# Altium project sumo.PrjPCB
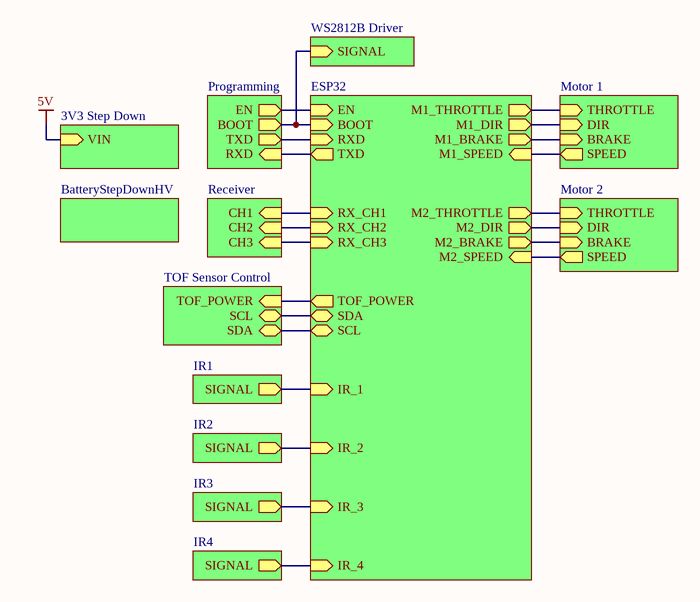
[diagram p0: sumo.SchDoc]
11 sheets, 167 parts. Net scope: hierarchical (ports join the sheet entries above them; power ports are global).
Board file: sumo.PcbDoc
Sheets:
  sumo.SchDoc
    3V3 Step Down = 3V3StepDown.SchDoc
    ESP32 = ESP32.SchDoc
    Motor 1 = MotorDriver.SchDoc
    Receiver = Receiver.SchDoc
    Programming = Programming.SchDoc
    TOF Sensor Control = TOFSensorControl.SchDoc
      VL53L0X_A = TOFSensor.SchDoc
      VL53L0X_B = TOFSensor.SchDoc
      VL53L0X_C = TOFSensor.SchDoc
      VL53L0X_D = TOFSensor.SchDoc
    WS2812B Driver = WS2812BDriver.SchDoc
    Motor 2 = MotorDriver.SchDoc
    BatteryStepDownHV = BatteryStepDownHV.SchDoc
    IR1 = IR.SchDoc
    IR2 = IR.SchDoc
    IR3 = IR.SchDoc
    IR4 = IR.SchDoc

## Sheet sumo.SchDoc
size A4

### Sub-sheets
3V3 Step Down = 3V3StepDown.SchDoc: VIN (in)
BatteryStepDownHV = BatteryStepDownHV.SchDoc: no entries
ESP32 = ESP32.SchDoc: EN (in), BOOT (in), RXD (in), TXD (out), M2_BRAKE (out), M1_BRAKE (out), M2_THROTTLE (out), M1_THROTTLE (out), RX_CH3 (in), M2_DIR (out), M1_DIR (out), RX_CH2 (in), RX_CH1 (in), IR_4 (in), IR_3 (in), IR_2 (in), IR_1 (in), SDA (bidir), SCL (bidir), TOF_POWER (out), M1_SPEED (in), M2_SPEED (in)
IR1 = IR.SchDoc: SIGNAL (out)
IR2 = IR.SchDoc: SIGNAL (out)
IR3 = IR.SchDoc: SIGNAL (out)
IR4 = IR.SchDoc: SIGNAL (out)
Motor 1 = MotorDriver.SchDoc: THROTTLE (in), DIR (in), BRAKE (in), SPEED (out)
Motor 2 = MotorDriver.SchDoc: THROTTLE (in), DIR (in), BRAKE (in), SPEED (out)
Programming = Programming.SchDoc: EN (out), BOOT (out), TXD (out), RXD (in)
Receiver = Receiver.SchDoc: CH1 (in), CH2 (in), CH3 (in)
TOF Sensor Control = TOFSensorControl.SchDoc: TOF_POWER (in), SCL (bidir), SDA (bidir)
WS2812B Driver = WS2812BDriver.SchDoc: SIGNAL (in)

### Nets
BOOT: sheet ESP32/BOOT, sheet Programming/BOOT, sheet WS2812B Driver/SIGNAL
EN: sheet ESP32/EN, sheet Programming/EN
RXD: sheet ESP32/RXD, sheet Programming/TXD
SCL: sheet ESP32/SCL, sheet TOF Sensor Control/SDA
SDA: sheet ESP32/SDA, sheet TOF Sensor Control/SCL
TXD: sheet ESP32/TXD, sheet Programming/RXD
NetC13_1_2: sheet ESP32/IR_1, sheet IR1/SIGNAL
NetC13_2_2: sheet ESP32/IR_2, sheet IR2/SIGNAL
NetC13_3_2: sheet ESP32/IR_3, sheet IR3/SIGNAL
NetC13_4_2: sheet ESP32/IR_4, sheet IR4/SIGNAL
NetR17_1_1: sheet ESP32/M1_THROTTLE, sheet Motor 1/THROTTLE
NetR17_2_1: sheet ESP32/M2_THROTTLE, sheet Motor 2/THROTTLE
NetR18_1_1: sheet ESP32/M1_DIR, sheet Motor 1/DIR
NetR18_2_1: sheet ESP32/M2_DIR, sheet Motor 2/DIR
NetR19_1_1: sheet ESP32/M1_BRAKE, sheet Motor 1/BRAKE
NetR19_2_1: sheet ESP32/M2_BRAKE, sheet Motor 2/BRAKE
NetR21_1_1: sheet ESP32/M1_SPEED, sheet Motor 1/SPEED
NetR21_2_1: sheet ESP32/M2_SPEED, sheet Motor 2/SPEED
NetR31_1: sheet ESP32/RX_CH3, sheet Receiver/CH3
NetR32_1: sheet ESP32/RX_CH2, sheet Receiver/CH2
NetR33_1: sheet ESP32/RX_CH1, sheet Receiver/CH1
NetR41_2: sheet ESP32/TOF_POWER, sheet TOF Sensor Control/TOF_POWER

## Sheet 3V3StepDown.SchDoc
size A4
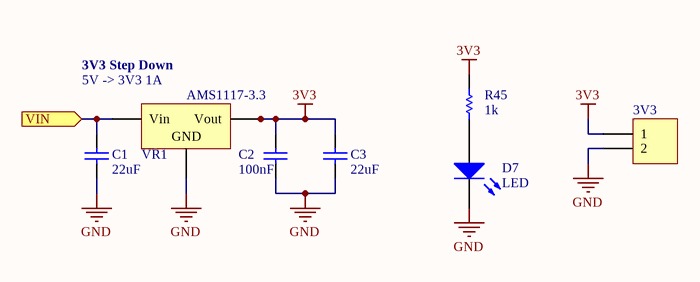
[diagram p1: 3V3StepDown.SchDoc]

### Parts
3V3  Header 2  [HDR1X2]  (value not drawn)
C1  value 22uF  [J1-0603]  (hidden comment: Cap)
C2  value 100nF  [J1-0603]  (hidden comment: Cap)
C3  value 22uF  [J1-0603]  (hidden comment: Cap)
D7  LED  [J1-0603 LED]
R45  value 1k  [J1-0603]  (hidden comment: Res1)
VR1  AMS1117-3.3  [SOT223-4M]

### Ports
VIN (in)

### Nets
3V3: 3V3.1 C2.2 C3.1 R45.2 VR1.2(Vout) VR1.4(Vout)
5V: C1.1 VR1.3(Vin) ; port VIN
GND: 3V3.2 C1.2 C2.1 C3.2 D7.2(K) VR1.1(GND)
NetD7_1: D7.1(A) R45.1

### Notes on the sheet
- (near VR1) 3V3 Step Down
- (near VR1) 5V -> 3V3 1A

### Library data of the parts
3V3 = Header 2: Header, 2-Pin; LatestRevisionDate: 17-Jul-2002; LatestRevisionNote: Re-released for DXP Platform.; Publisher: Altium Limited
C1-C3 = Cap: Capacitor; Published: 8-Jun-2000; LatestRevisionDate: 17-Jul-2002; LatestRevisionNote: Re-released for DXP Platform.; PackageReference: RAD-0.3; Publisher: Altium Limited; PackageDescription: Radial Cap, Thru-Hole; 2 Leads; 0.3 in Pin Spacing
  C1 C3: LCSC: C109447
  C2: LCSC: C153795
R45 = Res1: Resistor; Published: 8-Jun-2000; LatestRevisionDate: 17-Jul-2002; LatestRevisionNote: Re-released for DXP Platform.; PackageReference: AXIAL-0.3; Publisher: Altium Limited; PackageDescription: Axial Device, Thru-Hole; 2 Leads; 0.3 in Pin Spacing
VR1 = Volt Reg: Voltage Regulator; Published: 24-Mar-1999; LatestRevisionDate: 29-May-2009; LatestRevisionNote: IPC-7351 Footprint Added.; PackageReference: D2PAK; Publisher: Altium Limited; PackageDescription: 3-Pin Transistor Outline Package 2.54 mm Pitch, 15.1 mm Lead Span; LCSC: C165482
D7 = LED: Published: 8-Jun-2000; LatestRevisionDate: 17-Jul-2002; LatestRevisionNote: Re-released for DXP Platform.; PackageVersion: Feb-2002; PackageReference: 3.2X1.6X1.1; Publisher: Altium Limited; PackageDescription: SM LED; 2 Flat Leads; LCSC: C205450

## Sheet ESP32.SchDoc
size A4
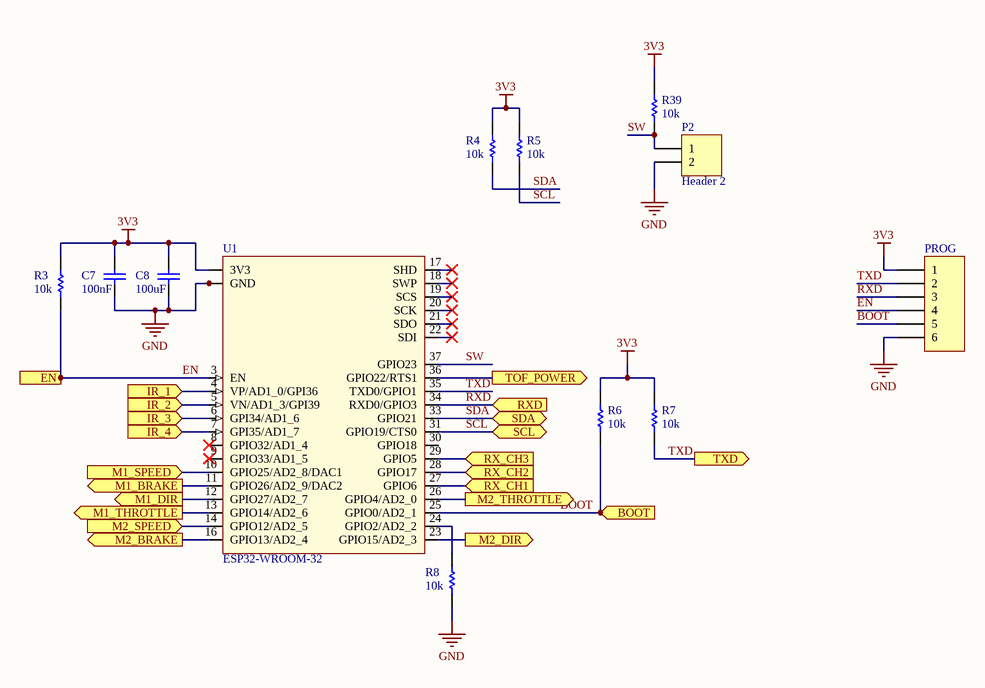
[diagram p2: ESP32.SchDoc]

### Parts
C7  value 100nF  [J1-0603]  (hidden comment: Cap)
C8  value 100uF  [C1210_M]  (hidden comment: Cap)
P2  Header 2  [HDR1X2]
PROG  Header 6  [HDR1X6]  (value not drawn)
R3  value 10k  [J1-0603]  (hidden comment: Res1)
R4  value 10k  [J1-0603]  (hidden comment: Res1)
R5  value 10k  [J1-0603]  (hidden comment: Res1)
R6  value 10k  [J1-0603]  (hidden comment: Res1)
R7  value 10k  [J1-0603]  (hidden comment: Res1)
R8  value 10k  [J1-0603]  (hidden comment: Res1)
R39  value 10k  [J1-0603]  (hidden comment: Res1)
U1  ESP32-WROOM-32  [ESP32-WROOM-32]

### Ports
BOOT (in), EN (in), IR_1 (in), IR_2 (in), IR_3 (in), IR_4 (in), M1_BRAKE (out), M1_DIR (out), M1_SPEED (in), M1_THROTTLE (out), M2_BRAKE (out), M2_DIR (out), M2_SPEED (in), M2_THROTTLE (out), RX_CH1 (in), RX_CH2 (in), RX_CH3 (in), RXD (in), SCL (bidir), SDA (bidir), TOF_POWER (out), TXD (out)

### Nets
3V3: C7.2 C8.2 PROG.1 R3.2 R4.2 R5.2 R6.2 R7.2 R39.2 U1.2(3V3)
GND: C7.1 C8.1 P2.2 PROG.6 R8.1 U1.1(GND) U1.15(GND) U1.38(GND) U1.39(GND)
BOOT: PROG.5 R6.1 U1.25(GPIO0/AD2_1) ; port BOOT
EN: PROG.4 R3.1 U1.3(EN) ; port EN
RXD: PROG.3 U1.34(RXD0/GPIO3) ; port RXD
SCL: R5.1 U1.31(GPIO19/CTS0) ; port SCL
SDA: R4.1 U1.33(GPIO21) ; port SDA
SW: P2.1 R39.1 U1.37(GPIO23)
TXD: PROG.2 R7.1 U1.35(TXD0/GPIO1) ; port TXD
NetC13_1_2: U1.4(VP/AD1_0/GPI36) ; port IR_1
NetC13_2_2: U1.5(VN/AD1_3/GPI39) ; port IR_2
NetC13_3_2: U1.6(GPI34/AD1_6) ; port IR_3
NetC13_4_2: U1.7(GPI35/AD1_7) ; port IR_4
NetR8_2: R8.2 U1.24(GPIO2/AD2_2)
NetR17_1_1: U1.13(GPIO14/AD2_6) ; port M1_THROTTLE
NetR17_2_1: U1.26(GPIO4/AD2_0) ; port M2_THROTTLE
NetR18_1_1: U1.12(GPIO27/AD2_7) ; port M1_DIR
NetR18_2_1: U1.23(GPIO15/AD2_3) ; port M2_DIR
NetR19_1_1: U1.11(GPIO26/AD2_9/DAC2) ; port M1_BRAKE
NetR19_2_1: U1.16(GPIO13/AD2_4) ; port M2_BRAKE
NetR21_1_1: U1.10(GPIO25/AD2_8/DAC1) ; port M1_SPEED
NetR21_2_1: U1.14(GPIO12/AD2_5) ; port M2_SPEED
NetR31_1: U1.29(GPIO5) ; port RX_CH3
NetR32_1: U1.28(GPIO17) ; port RX_CH2
NetR33_1: U1.27(GPIO6) ; port RX_CH1
NetR41_2: U1.36(GPIO22/RTS1) ; port TOF_POWER

Not connected (* = marked no-connect by the designer): U1 8(GPIO32/AD1_4)* 9(GPIO33/AD1_5)* 17(SHD)* 18(SWP)* 19(SCS)* 20(SCK)* 21(SDO)* 22(SDI)* 30(GPIO18)

### Library data of the parts
C7 C8 = Cap: Capacitor; Published: 8-Jun-2000; LatestRevisionDate: 17-Jul-2002; LatestRevisionNote: Re-released for DXP Platform.; PackageReference: RAD-0.3; Publisher: Altium Limited; PackageDescription: Radial Cap, Thru-Hole; 2 Leads; 0.3 in Pin Spacing
  C7: LCSC: C153795
  C8: LCSC: C92794
P2 = Header 2: Header, 2-Pin; LatestRevisionDate: 17-Jul-2002; LatestRevisionNote: Re-released for DXP Platform.; Publisher: Altium Limited
PROG = Header 6: Header, 6-Pin; LatestRevisionDate: 17-Jul-2002; LatestRevisionNote: Re-released for DXP Platform.; Publisher: Altium Limited
R3-R8 R39 = Res1: Resistor; Published: 8-Jun-2000; LatestRevisionDate: 17-Jul-2002; LatestRevisionNote: Re-released for DXP Platform.; PackageReference: AXIAL-0.3; Publisher: Altium Limited; PackageDescription: Axial Device, Thru-Hole; 2 Leads; 0.3 in Pin Spacing

## Sheet MotorDriver.SchDoc
size A4
Used 2 times, as channels Motor 1, Motor 2. Parts and nets are listed once, with the designators drawn on the sheet.
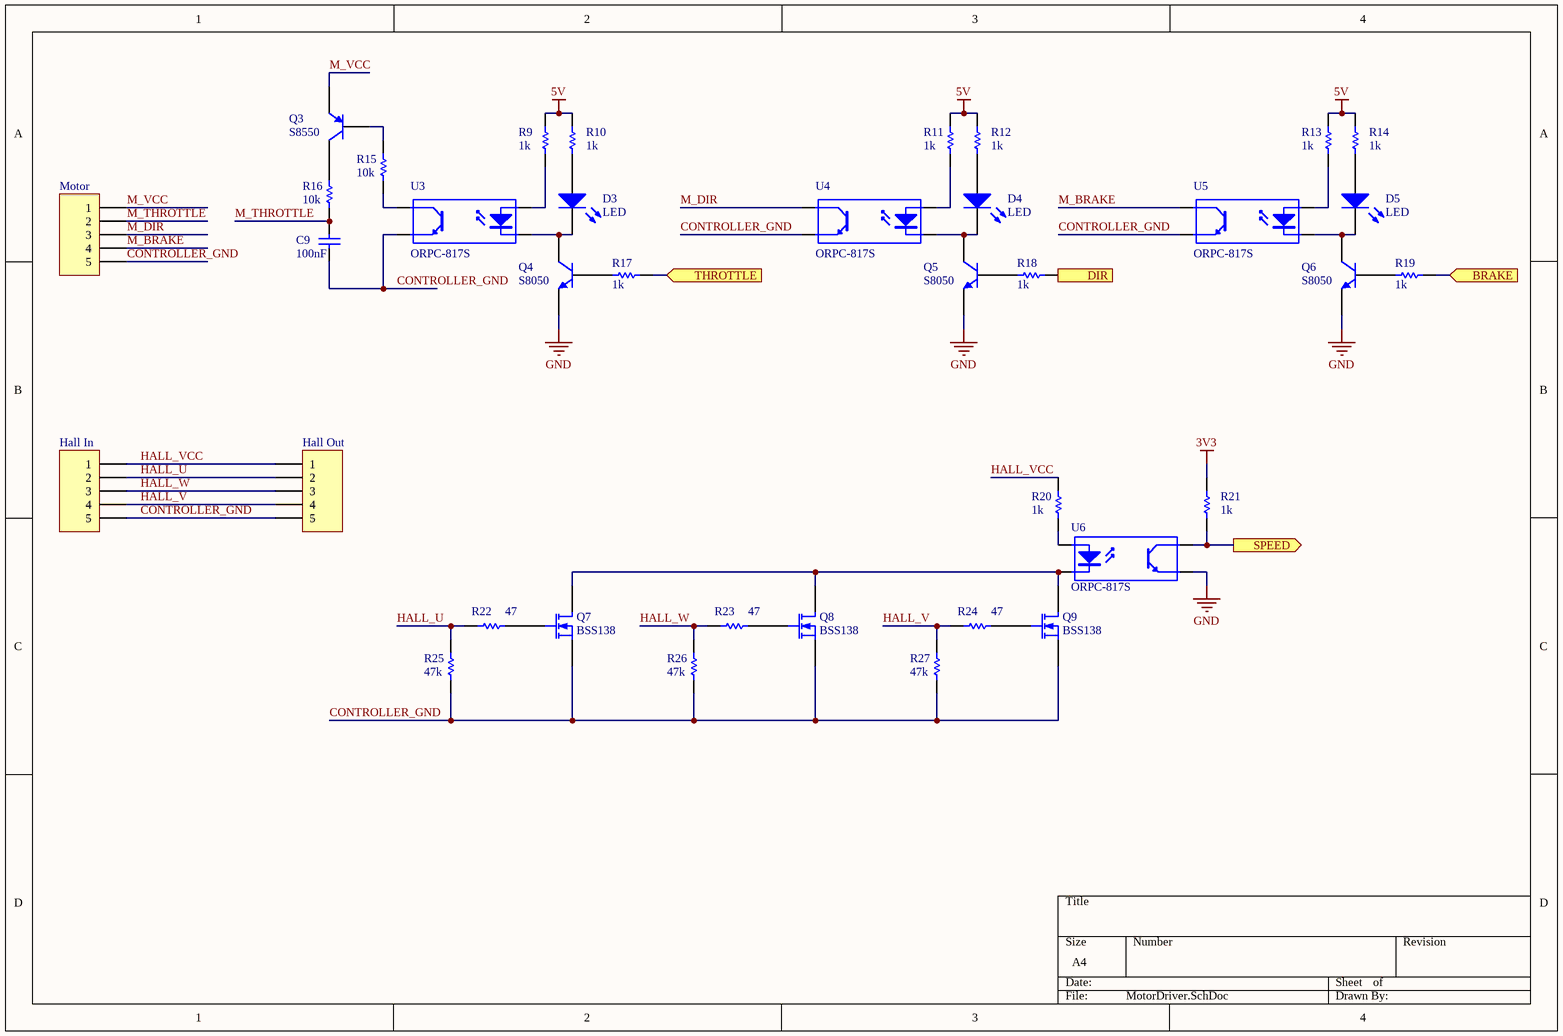
[diagram p3: MotorDriver.SchDoc]

### Parts
C9  value 100nF  [J1-0603]  (hidden comment: Cap)
D3  LED  [J1-0603 LED]
D4  LED  [J1-0603 LED]
D5  LED  [J1-0603 LED]
Hall_In  Motor 1  [HDR1X5]  (value not drawn)
Hall_Out  Motor 1  [HDR1X5]  (value not drawn)
Motor  Motor 1  [HDR1X5]  (value not drawn)
Q3  S8550  [SOT23-3M]
Q4  S8050  [SOT23-3M]
Q5  S8050  [SOT23-3M]
Q6  S8050  [SOT23-3M]
Q7  BSS138  [SOT23-3M]
Q8  BSS138  [SOT23-3M]
Q9  BSS138  [SOT23-3M]
R9  value 1k  [J1-0603]  (hidden comment: Res1)
R10  value 1k  [J1-0603]  (hidden comment: Res1)
R11  value 1k  [J1-0603]  (hidden comment: Res1)
R12  value 1k  [J1-0603]  (hidden comment: Res1)
R13  value 1k  [J1-0603]  (hidden comment: Res1)
R14  value 1k  [J1-0603]  (hidden comment: Res1)
R15  value 10k  [J1-0603]  (hidden comment: Res1)
R16  value 10k  [J1-0603]  (hidden comment: Res1)
R17  value 1k  [J1-0603]  (hidden comment: Res1)
R18  value 1k  [J1-0603]  (hidden comment: Res1)
R19  value 1k  [J1-0603]  (hidden comment: Res1)
R20  value 1k  [J1-0603]  (hidden comment: Res1)
R21  value 1k  [J1-0603]  (hidden comment: Res1)
R22  value 47  [J1-0603]  (hidden comment: Res1)
R23  value 47  [J1-0603]  (hidden comment: Res1)
R24  value 47  [J1-0603]  (hidden comment: Res1)
R25  value 47k  [J1-0603]  (hidden comment: Res1)
R26  value 47k  [J1-0603]  (hidden comment: Res1)
R27  value 47k  [J1-0603]  (hidden comment: Res1)
U3  ORPC-817S  [SMD-4]
U4  ORPC-817S  [SMD-4]
U5  ORPC-817S  [SMD-4]
U6  ORPC-817S  [SMD-4]

### Ports
BRAKE (in), DIR (in), SPEED (out), THROTTLE (in)

### Nets
3V3: R21.2
5V: R9.2 R10.2 R11.2 R12.2 R13.2 R14.2
GND: Q4.2(E) Q5.2(E) Q6.2(E) U6.3(E)
BRAKE: R19.1 ; port BRAKE
CONTROLLER_GND: C9.1 Hall_In.5 Hall_Out.5 Motor.5 Q7.2(S) Q8.2(S) Q9.2(S) R25.1 R26.1 R27.1 U3.3(E) U4.3(E) U5.3(E)
DIR: R18.1 ; port DIR
HALL_U: Hall_In.2 Hall_Out.2 R22.2 R25.2
HALL_V: Hall_In.4 Hall_Out.4 R24.2 R27.2
HALL_VCC: Hall_In.1 Hall_Out.1 R20.2
HALL_W: Hall_In.3 Hall_Out.3 R23.2 R26.2
M_BRAKE: Motor.4 U5.4(C)
M_DIR: Motor.3 U4.4(C)
M_THROTTLE: C9.2 Motor.2 R16.1
M_VCC: Motor.1 Q3.2(E)
SPEED: R21.1 U6.4(C) ; port SPEED
THROTTLE: R17.1 ; port THROTTLE
NetD3_1: D3.1(A) R10.1
NetD3_2: D3.2(K) Q4.3(C) U3.2(K)
NetD4_1: D4.1(A) R12.1
NetD4_2: D4.2(K) Q5.3(C) U4.2(K)
NetD5_1: D5.1(A) R14.1
NetD5_2: D5.2(K) Q6.3(C) U5.2(K)
NetQ3_1: Q3.1(B) R15.2
NetQ3_3: Q3.3(C) R16.2
NetQ4_1: Q4.1(B) R17.2
NetQ5_1: Q5.1(B) R18.2
NetQ6_1: Q6.1(B) R19.2
NetQ7_1: Q7.1(G) R22.1
NetQ7_3: Q7.3(D) Q8.3(D) Q9.3(D) U6.2(K)
NetQ8_1: Q8.1(G) R23.1
NetQ9_1: Q9.1(G) R24.1
NetR9_1: R9.1 U3.1(A)
NetR11_1: R11.1 U4.1(A)
NetR13_1: R13.1 U5.1(A)
NetR15_1: R15.1 U3.4(C)
NetR20_1: R20.1 U6.1(A)

### Channels
Motor 1: designators C9=C9_1 D3=D3_1 D4=D4_1 D5=D5_1 Hall In=Hall_In_1 Hall Out=Hall_Out_1 Motor=Motor_1 Q3=Q3_1 Q4=Q4_1 Q5=Q5_1 Q6=Q6_1 Q7=Q7_1 Q8=Q8_1 Q9=Q9_1 R9=R9_1 R10=R10_1 R11=R11_1 R12=R12_1 R13=R13_1 R14=R14_1 R15=R15_1 R16=R16_1 R17=R17_1 R18=R18_1 R19=R19_1 R20=R20_1 R21=R21_1 R22=R22_1 R23=R23_1 R24=R24_1 R25=R25_1 R26=R26_1 R27=R27_1 U3=U3_1 U4=U4_1 U5=U5_1 U6=U6_1; ports BRAKE=NetR19_1_1 DIR=NetR18_1_1 SPEED=NetR21_1_1 THROTTLE=NetR17_1_1
Motor 2: designators C9=C9_2 D3=D3_2 D4=D4_2 D5=D5_2 Hall In=Hall_In_2 Hall Out=Hall_Out_2 Motor=Motor_2 Q3=Q3_2 Q4=Q4_2 Q5=Q5_2 Q6=Q6_2 Q7=Q7_2 Q8=Q8_2 Q9=Q9_2 R9=R9_2 R10=R10_2 R11=R11_2 R12=R12_2 R13=R13_2 R14=R14_2 R15=R15_2 R16=R16_2 R17=R17_2 R18=R18_2 R19=R19_2 R20=R20_2 R21=R21_2 R22=R22_2 R23=R23_2 R24=R24_2 R25=R25_2 R26=R26_2 R27=R27_2 U3=U3_2 U4=U4_2 U5=U5_2 U6=U6_2; ports BRAKE=NetR19_2_1 DIR=NetR18_2_1 SPEED=NetR21_2_1 THROTTLE=NetR17_2_1

### Library data of the parts
C9 = Cap: Capacitor; Published: 8-Jun-2000; LatestRevisionDate: 17-Jul-2002; LatestRevisionNote: Re-released for DXP Platform.; PackageReference: RAD-0.3; Publisher: Altium Limited; PackageDescription: Radial Cap, Thru-Hole; 2 Leads; 0.3 in Pin Spacing; LCSC: C153795
Hall_In Hall_Out Motor = Header 5: Control Signals from a E-Bike controller; LatestRevisionDate: 17-Jul-2002; LatestRevisionNote: Re-released for DXP Platform.; Publisher: Altium Limited
Q3 = S8550: PNP General Purpose Amplifier; Published: 8-Jun-2000; LatestRevisionDate: 15-Jan-2003; LatestRevisionNote: PCB Footprint 'BCY-W3/D4.7' replaced; DatasheetVersion: 1997; PackageVersion: Sep-1998; PackageReference: TO-92A; Publisher: Altium Limited; PackageDescription: TO, Flat Index; 3 In-Line, Axial Leads; Body Dia. 4.5mm; Leads 0.51 x 0.48 mm (max); LCSC: C111271
Q4-Q6 = S8050: NPN General Purpose Amplifier; Published: 8-Jun-2000; LatestRevisionDate: 15-Jan-2003; LatestRevisionNote: PCB Footprint 'BCY-W3/D4.7' replaced; DatasheetVersion: 1997; PackageVersion: Sep-1998; PackageReference: TO-92A; Publisher: Altium Limited; PackageDescription: TO, Flat Index; 3 In-Line, Axial Leads; Body Dia. 4.5mm; Leads 0.51 x 0.48 mm (max); LCSC: C259988
Q7-Q9 = BSS138: N-Channel MOSFET; Published: 8-Jun-2000; LatestRevisionDate: 17-Jul-2002; LatestRevisionNote: Re-released for DXP Platform.; PackageVersion: 1995/1996; PackageReference: E3; Publisher: Altium Limited; PackageDescription: TO, Flat Index; 3 In-Line, Axial Leads; Body Dia. 4.6mm; Lead Dia. 0.5 mm (max); LCSC: C112239
R9-R27 = Res1: Resistor; Published: 8-Jun-2000; LatestRevisionDate: 17-Jul-2002; LatestRevisionNote: Re-released for DXP Platform.; PackageReference: AXIAL-0.3; Publisher: Altium Limited; PackageDescription: Axial Device, Thru-Hole; 2 Leads; 0.3 in Pin Spacing
U3-U6 = ORPC-817S: 4-Pin Phototransistor Optocoupler; Published: 24-Mar-1999; LatestRevisionDate: 04-Mar-2005; LatestRevisionNote: Sch pins 3 & 4 Swapped.; DatasheetVersion: Nov-2003; PackageReference: DIP-4; Publisher: Altium Limited
  U3-U5: LCSC: C231233
D3-D5 = LED: Published: 8-Jun-2000; LatestRevisionDate: 17-Jul-2002; LatestRevisionNote: Re-released for DXP Platform.; PackageVersion: Feb-2002; PackageReference: 3.2X1.6X1.1; Publisher: Altium Limited; PackageDescription: SM LED; 2 Flat Leads; LCSC: C205450

## Sheet Receiver.SchDoc
size A4
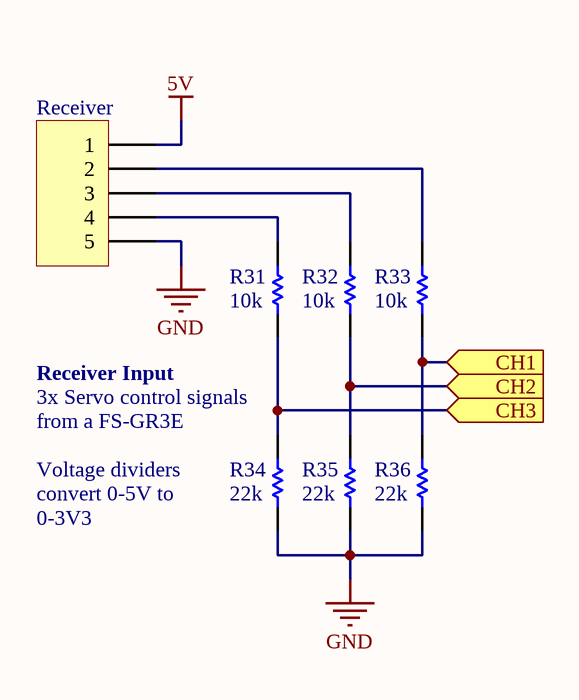
[diagram p4: Receiver.SchDoc]

### Parts
R31  value 10k  [J1-0603]  (hidden comment: Res1)
R32  value 10k  [J1-0603]  (hidden comment: Res1)
R33  value 10k  [J1-0603]  (hidden comment: Res1)
R34  value 22k  [J1-0603]  (hidden comment: Res1)
R35  value 22k  [J1-0603]  (hidden comment: Res1)
R36  value 22k  [J1-0603]  (hidden comment: Res1)
Receiver  (no value)  [HDR1X5]

### Ports
CH1 (in), CH2 (in), CH3 (in)

### Nets
5V: Receiver.1
GND: R34.1 R35.1 R36.1 Receiver.5
NetR31_1: R31.1 R34.2 ; port CH3
NetR31_2: R31.2 Receiver.4
NetR32_1: R32.1 R35.2 ; port CH2
NetR32_2: R32.2 Receiver.3
NetR33_1: R33.1 R36.2 ; port CH1
NetR33_2: R33.2 Receiver.2

### Notes on the sheet
- Receiver Input
- 3x Servo control signals
- from a FS-GR3E
- (near R34) Voltage dividers
- (near R34) convert 0-5V to
- 0-3V3

### Library data of the parts
R31-R36 = Res1: Resistor; Published: 8-Jun-2000; LatestRevisionDate: 17-Jul-2002; LatestRevisionNote: Re-released for DXP Platform.; PackageReference: AXIAL-0.3; Publisher: Altium Limited; PackageDescription: Axial Device, Thru-Hole; 2 Leads; 0.3 in Pin Spacing
Receiver = Header 5: Receiver Input; LatestRevisionDate: 17-Jul-2002; LatestRevisionNote: Re-released for DXP Platform.; Publisher: Altium Limited

## Sheet Programming.SchDoc
size A4
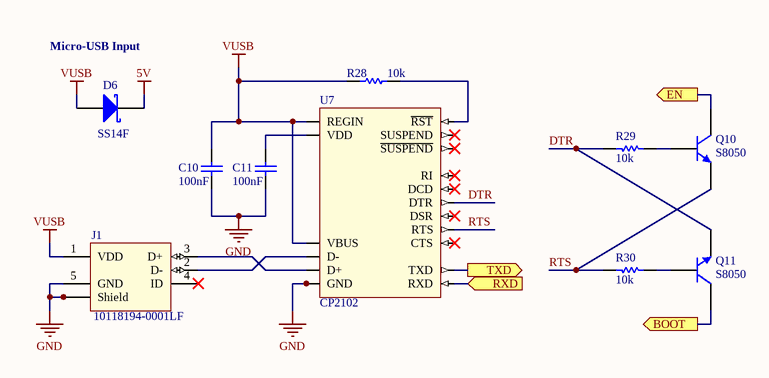
[diagram p5: Programming.SchDoc]

### Parts
C10  value 100nF  [J1-0603]  (hidden comment: Cap)
C11  value 100nF  [J1-0603]  (hidden comment: Cap)
D6  SS14F  [SS14]
J1  10118194-0001LF  [10103594-0001LF]
Q10  S8050  [SOT23-3M]
Q11  S8050  [SOT23-3M]
R28  value 10k  [J1-0603]  (hidden comment: Res1)
R29  value 10k  [J1-0603]  (hidden comment: Res1)
R30  value 10k  [J1-0603]  (hidden comment: Res1)
U7  CP2102  [QFN-28]

### Ports
BOOT (out), EN (out), RXD (in), TXD (out)

### Nets
5V: D6.2(K)
GND: C10.1 C11.1 J1.5(GND) J1.6(Shield) J1.7(Shield) J1.8(Shield) J1.9(Shield) U7.3(GND) U7.29
VUSB: C10.2 D6.1(A) J1.1(VDD) R28.2 U7.7(REGIN) U7.8(VBUS)
BOOT: Q11.3(C) ; port BOOT
DTR: Q11.2(E) R29.1 U7.28(DTR)
EN: Q10.3(C) ; port EN
RTS: Q10.2(E) R30.1 U7.24(RTS)
RXD: U7.26(TXD) ; port TXD
TXD: U7.25(RXD) ; port RXD
NetC11_2: C11.2 U7.6(VDD)
NetJ1_2: J1.2(D-) U7.5(D-)
NetJ1_3: J1.3(D+) U7.4(D+)
NetQ10_1: Q10.1(B) R29.2
NetQ11_1: Q11.1(B) R30.2
NetR28_1: R28.1 U7.9(~{RST})

Not connected (* = marked no-connect by the designer): J1 4(ID)*; U7 1(DCD)* 2(RI)* 11(~{SUSPEND})* 12(SUSPEND)* 23(CTS)* 27(DSR)*

### Notes on the sheet
- Micro-USB Input

### Library data of the parts
C10 C11 = Cap: Capacitor; Published: 8-Jun-2000; LatestRevisionDate: 17-Jul-2002; LatestRevisionNote: Re-released for DXP Platform.; PackageReference: RAD-0.3; Publisher: Altium Limited; PackageDescription: Radial Cap, Thru-Hole; 2 Leads; 0.3 in Pin Spacing; LCSC: C153795
D6 = D Schottky: Schottky Diode; Published: 8-Jun-2000; LatestRevisionDate: 17-Jul-2002; LatestRevisionNote: Re-released for DXP Platform.; PackageReference: SMB; Publisher: Altium Limited; PackageDescription: DO-214-AA/SMB; 2 C-Bend Leads; Body 5.3 x 3.6 mm, inc. leads (LxW); Code_JEDEC: DO-214-AA; LCSC: C110213
J1 = 10118194-0001LF_1: Conn Micro USB Type B RCP 5 POS 0.65mm Solder RA SMD 5 Terminal 1 Port T/R; MF: FCI; RS: 714-2347; Availability: Good; Price: 0.23 USD; MP: 10118194-0001LF; Package: DIP-4 FCI; Value: *
Q10 Q11 = S8050: NPN General Purpose Amplifier; Published: 8-Jun-2000; LatestRevisionDate: 15-Jan-2003; LatestRevisionNote: PCB Footprint 'BCY-W3/D4.7' replaced; DatasheetVersion: 1997; PackageVersion: Sep-1998; PackageReference: TO-92A; Publisher: Altium Limited; PackageDescription: TO, Flat Index; 3 In-Line, Axial Leads; Body Dia. 4.5mm; Leads 0.51 x 0.48 mm (max); LCSC: C259988
R28-R30 = Res1: Resistor; Published: 8-Jun-2000; LatestRevisionDate: 17-Jul-2002; LatestRevisionNote: Re-released for DXP Platform.; PackageReference: AXIAL-0.3; Publisher: Altium Limited; PackageDescription: Axial Device, Thru-Hole; 2 Leads; 0.3 in Pin Spacing

## Sheet TOFSensorControl.SchDoc
size A4
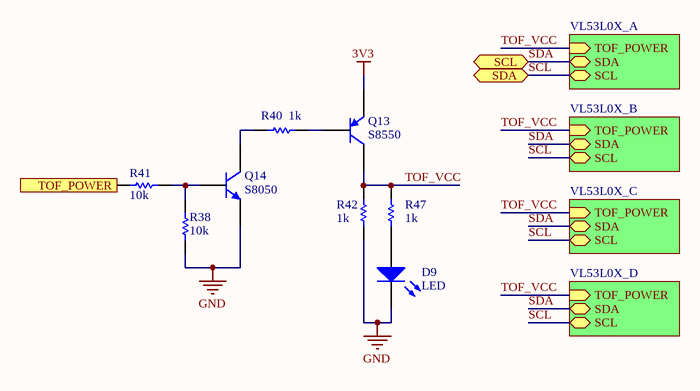
[diagram p6: TOFSensorControl.SchDoc]

### Parts
D9  LED  [J1-0603 LED]
Q13  S8550  [SOT23-3M]
Q14  S8050  [SOT23-3M]
R38  value 10k  [J1-0603]  (hidden comment: Res1)
R40  value 1k  [J1-0603]  (hidden comment: Res1)
R41  value 10k  [J1-0603]  (hidden comment: Res1)
R42  value 1k  [J1-0603]  (hidden comment: Res1)
R47  value 1k  [J1-0603]  (hidden comment: Res1)

### Sub-sheets
VL53L0X_A = TOFSensor.SchDoc: SDA (bidir), SCL (bidir), TOF_POWER (in)  | R_VALUE: 0
VL53L0X_B = TOFSensor.SchDoc: SCL (bidir), TOF_POWER (in), SDA (bidir)  | R_VALUE: 10k
VL53L0X_C = TOFSensor.SchDoc: SCL (bidir), TOF_POWER (in), SDA (bidir)  | R_VALUE: 20k
VL53L0X_D = TOFSensor.SchDoc: SCL (bidir), TOF_POWER (in), SDA (bidir)  | R_VALUE: 30k

### Ports
SCL (bidir), SDA (bidir), TOF_POWER (in)

### Nets
3V3: Q13.2(E)
GND: D9.2(K) Q14.2(E) R38.2 R42.1
SCL: port SDA, sheet VL53L0X_A/SCL, sheet VL53L0X_B/SCL, sheet VL53L0X_C/SCL, sheet VL53L0X_D/SCL
SDA: port SCL, sheet VL53L0X_A/SDA, sheet VL53L0X_B/SDA, sheet VL53L0X_C/SDA, sheet VL53L0X_D/SDA
TOF_VCC: Q13.3(C) R42.2 R47.2 ; sheet VL53L0X_A/TOF_POWER, sheet VL53L0X_B/TOF_POWER, sheet VL53L0X_C/TOF_POWER, sheet VL53L0X_D/TOF_POWER
NetD9_1: D9.1(A) R47.1
NetQ13_1: Q13.1(B) R40.1
NetQ14_1: Q14.1(B) R38.1 R41.1
NetQ14_3: Q14.3(C) R40.2
NetR41_2: R41.2 ; port TOF_POWER

### Library data of the parts
Q13 = S8550: PNP General Purpose Amplifier; Published: 8-Jun-2000; LatestRevisionDate: 15-Jan-2003; LatestRevisionNote: PCB Footprint 'BCY-W3/D4.7' replaced; DatasheetVersion: 1997; PackageVersion: Sep-1998; PackageReference: TO-92A; Publisher: Altium Limited; PackageDescription: TO, Flat Index; 3 In-Line, Axial Leads; Body Dia. 4.5mm; Leads 0.51 x 0.48 mm (max); LCSC: C111271
Q14 = S8050: NPN General Purpose Amplifier; Published: 8-Jun-2000; LatestRevisionDate: 15-Jan-2003; LatestRevisionNote: PCB Footprint 'BCY-W3/D4.7' replaced; DatasheetVersion: 1997; PackageVersion: Sep-1998; PackageReference: TO-92A; Publisher: Altium Limited; PackageDescription: TO, Flat Index; 3 In-Line, Axial Leads; Body Dia. 4.5mm; Leads 0.51 x 0.48 mm (max); LCSC: C259988
R38 R40-R42 R47 = Res1: Resistor; Published: 8-Jun-2000; LatestRevisionDate: 17-Jul-2002; LatestRevisionNote: Re-released for DXP Platform.; PackageReference: AXIAL-0.3; Publisher: Altium Limited; PackageDescription: Axial Device, Thru-Hole; 2 Leads; 0.3 in Pin Spacing
D9 = LED: Published: 8-Jun-2000; LatestRevisionDate: 17-Jul-2002; LatestRevisionNote: Re-released for DXP Platform.; PackageVersion: Feb-2002; PackageReference: 3.2X1.6X1.1; Publisher: Altium Limited; PackageDescription: SM LED; 2 Flat Leads; LCSC: C205450

## Sheet TOFSensor.SchDoc
size A4
Used 4 times, as channels TOF Sensor Control/VL53L0X_A, TOF Sensor Control/VL53L0X_B, TOF Sensor Control/VL53L0X_C, TOF Sensor Control/VL53L0X_D. Parts and nets are listed once, with the designators drawn on the sheet.
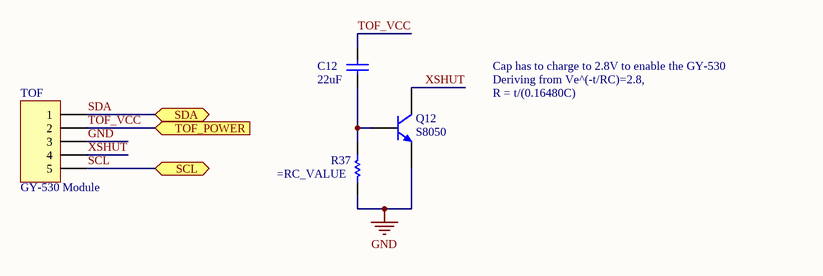
[diagram p7: TOFSensor.SchDoc]

### Parts
C12  value 22uF  [J1-0603]  (hidden comment: Cap)
Q12  S8050  [SOT23-3M]
R37  Res1  [J1-0603]  (value not drawn)
TOF  GY-530 Module  [HDR1X5]

### Ports
SCL (bidir), SDA (bidir), TOF_POWER (in)

### Nets
GND: Q12.2(E) R37.1 TOF.3
SCL: TOF.5 ; port SCL
SDA: TOF.1 ; port SDA
TOF_VCC: C12.1 TOF.2 ; port TOF_POWER
XSHUT: Q12.3(C) TOF.4
NetC12_2: C12.2 Q12.1(B) R37.2

### Channels
TOF Sensor Control/VL53L0X_A: designators end in _1; ports SCL=SCL SDA=SDA TOF_POWER=TOF_VCC
TOF Sensor Control/VL53L0X_B: designators end in _2; ports SCL=SCL SDA=SDA TOF_POWER=TOF_VCC
TOF Sensor Control/VL53L0X_C: designators end in _3; ports SCL=SCL SDA=SDA TOF_POWER=TOF_VCC
TOF Sensor Control/VL53L0X_D: designators end in _4; ports SCL=SCL SDA=SDA TOF_POWER=TOF_VCC

### Notes on the sheet
- Cap has to charge to 2.8V to enable the GY-530
- Deriving from Ve^(-t/RC)=2.8,
- R = t/(0.16480C)

### Library data of the parts
C12 = Cap: Capacitor; Published: 8-Jun-2000; LatestRevisionDate: 17-Jul-2002; LatestRevisionNote: Re-released for DXP Platform.; PackageReference: RAD-0.3; Publisher: Altium Limited; PackageDescription: Radial Cap, Thru-Hole; 2 Leads; 0.3 in Pin Spacing; LCSC: C109447
Q12 = S8050: NPN General Purpose Amplifier; Published: 8-Jun-2000; LatestRevisionDate: 15-Jan-2003; LatestRevisionNote: PCB Footprint 'BCY-W3/D4.7' replaced; DatasheetVersion: 1997; PackageVersion: Sep-1998; PackageReference: TO-92A; Publisher: Altium Limited; PackageDescription: TO, Flat Index; 3 In-Line, Axial Leads; Body Dia. 4.5mm; Leads 0.51 x 0.48 mm (max); LCSC: C259988
R37 = Res1: Resistor; Published: 8-Jun-2000; LatestRevisionDate: 17-Jul-2002; LatestRevisionNote: Re-released for DXP Platform.; PackageReference: AXIAL-0.3; Publisher: Altium Limited; PackageDescription: Axial Device, Thru-Hole; 2 Leads; 0.3 in Pin Spacing; Value: =RC_VALUE
TOF = Header 5: Header, 5-Pin; LatestRevisionDate: 17-Jul-2002; LatestRevisionNote: Re-released for DXP Platform.; Publisher: Altium Limited

## Sheet WS2812BDriver.SchDoc
size A4
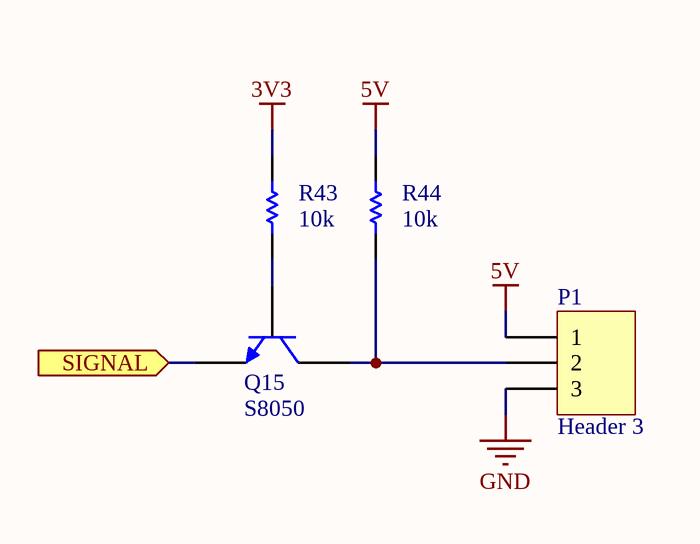
[diagram p8: WS2812BDriver.SchDoc]

### Parts
P1  Header 3  [HDR1X3]
Q15  S8050  [SOT23-3M]
R43  value 10k  [J1-0603]  (hidden comment: Res1)
R44  value 10k  [J1-0603]  (hidden comment: Res1)

### Ports
SIGNAL (in)

### Nets
3V3: R43.2
5V: P1.1 R44.2
GND: P1.3
BOOT: Q15.2(E) ; port SIGNAL
NetP1_2: P1.2 Q15.3(C) R44.1
NetQ15_1: Q15.1(B) R43.1

### Library data of the parts
P1 = Header 3: Header, 3-Pin; LatestRevisionDate: 17-Jul-2002; LatestRevisionNote: Re-released for DXP Platform.; Publisher: Altium Limited
Q15 = S8050: NPN General Purpose Amplifier; Published: 8-Jun-2000; LatestRevisionDate: 15-Jan-2003; LatestRevisionNote: PCB Footprint 'BCY-W3/D4.7' replaced; DatasheetVersion: 1997; PackageVersion: Sep-1998; PackageReference: TO-92A; Publisher: Altium Limited; PackageDescription: TO, Flat Index; 3 In-Line, Axial Leads; Body Dia. 4.5mm; Leads 0.51 x 0.48 mm (max); LCSC: C259988
R43 R44 = Res1: Resistor; Published: 8-Jun-2000; LatestRevisionDate: 17-Jul-2002; LatestRevisionNote: Re-released for DXP Platform.; PackageReference: AXIAL-0.3; Publisher: Altium Limited; PackageDescription: Axial Device, Thru-Hole; 2 Leads; 0.3 in Pin Spacing

## Sheet BatteryStepDownHV.SchDoc
size A4
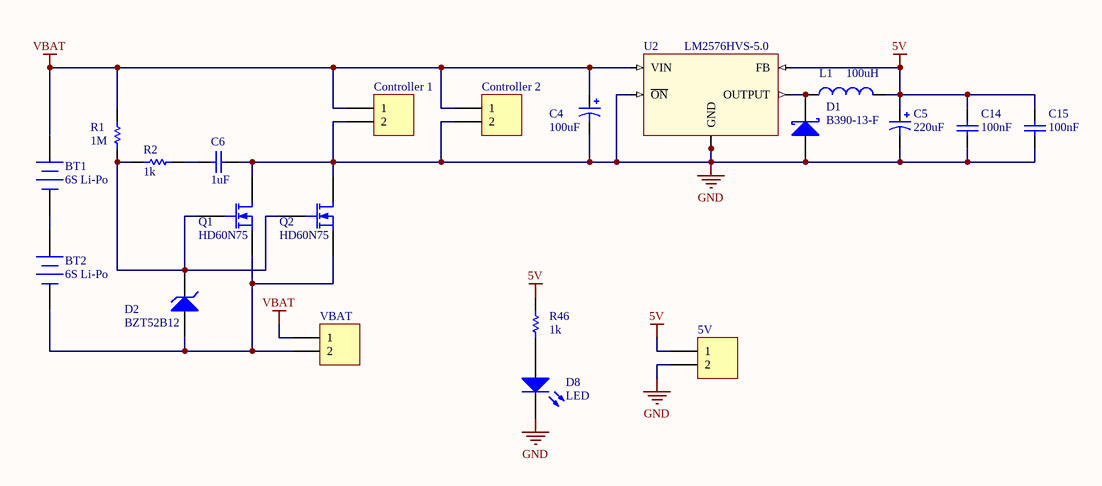
[diagram p9: BatteryStepDownHV.SchDoc]

### Parts
5V  Header 2  [HDR1X2]  (value not drawn)
BT1  6S Li-Po  [Wire Terminals]
BT2  6S Li-Po  [Wire Terminals]
C4  value 100uF  [10x10.5]  (hidden comment: Cap Pol1)
C5  value 220uF  [6.3X5.4]  (hidden comment: Cap Pol1)
C6  value 1uF  [6-0805_M]  (hidden comment: Cap)
C14  value 100nF  [J1-0603]  (hidden comment: Cap)
C15  value 100nF  [J1-0603]  (hidden comment: Cap)
Controller_1  Header 2  [Wire Terminals]  (value not drawn)
Controller_2  Header 2  [Wire Terminals]  (value not drawn)
D1  B390-13-F  [B390]
D2  BZT52B12  [SOD-123]
D8  LED  [J1-0603 LED]
L1  value 100uH  [SLF12575]  (hidden comment: Inductor)
Q1  HD60N75  [TO-252]
Q2  HD60N75  [TO-252]
R1  value 1M  [J1-0603]  (hidden comment: Res1)
R2  value 1k  [J1-0603]  (hidden comment: Res1)
R46  value 1k  [J1-0603]  (hidden comment: Res1)
U2  LM2576HVS-5.0  [KTT0005B]
VBAT  Header 2  [HDR1X2]  (value not drawn)

### Nets
5V: 5V.1 C5.1 C14.2 C15.2 L1.2 R46.2 U2.4(FB)
GND: 5V.2 C4.2 C5.2 C6.1 C14.1 C15.1 Controller_1.2 Controller_2.2 D1.1(A) D8.2(K) Q1.2(D) Q2.2(D) U2.3(GND) U2.5(~{ON}) U2.6(TAB)
VBAT: BT1.1(+) C4.1 Controller_1.1 Controller_2.1 R1.2 U2.1(VIN) VBAT.1
NetBT1_2: BT1.2(-) BT2.1(+)
NetBT2_2: BT2.2(-) D2.1(A) Q1.3(S) Q2.3(S) VBAT.2
NetC6_2: C6.2 R2.2
NetD1_2: D1.2(K) L1.1 U2.2(OUTPUT)
NetD2_2: D2.2(K) Q1.1(G) Q2.1(G) R1.1 R2.1
NetD8_1: D8.1(A) R46.1

### Library data of the parts
5V Controller_1 Controller_2 VBAT = Header 2: Header, 2-Pin; LatestRevisionDate: 17-Jul-2002; LatestRevisionNote: Re-released for DXP Platform.; Publisher: Altium Limited
BT1 BT2 = Battery: Multicell Battery; Published: 24-Mar-1999; LatestRevisionDate: 17-Jul-2002; LatestRevisionNote: Re-released for DXP Platform.; PackageReference: BAT-2; Publisher: Altium Limited; PackageDescription: Battery; 2 Leads
C4 C5 = Cap Pol1: Polarized Capacitor (Radial); Published: 8-Jun-2000; LatestRevisionDate: 17-Jul-2002; LatestRevisionNote: Re-released for DXP Platform.; PackageReference: RB7.6-15; Publisher: Altium Limited; PackageDescription: Polarized Capacitor (Radial); 2 Leads
  C4: LCSC: C59944
  C5: LCSC: C131157
C6 C14 C15 = Cap: Capacitor; Published: 8-Jun-2000; LatestRevisionDate: 17-Jul-2002; LatestRevisionNote: Re-released for DXP Platform.; PackageReference: RAD-0.3; Publisher: Altium Limited; PackageDescription: Radial Cap, Thru-Hole; 2 Leads; 0.3 in Pin Spacing
  C6: LCSC: C105952
  C14 C15: LCSC: C153795
D1 = D Schottky: Schottky Diode; Published: 8-Jun-2000; LatestRevisionDate: 17-Jul-2002; LatestRevisionNote: Re-released for DXP Platform.; PackageReference: SMB; Publisher: Altium Limited; PackageDescription: DO-214-AA/SMB; 2 C-Bend Leads; Body 5.3 x 3.6 mm, inc. leads (LxW); Code_JEDEC: DO-214-AA; LCSC: C134458
D2 = D Zener: Zener Diode; Published: 8-Jun-2000; LatestRevisionDate: 17-Jul-2002; LatestRevisionNote: Re-released for DXP Platform.; PackageReference: DIODE-0.7; Publisher: Altium Limited; PackageDescription: Diode, Thru-Hole; 2 Leads; 0.7 in Pin Spacing; LCSC: C213153
L1 = Inductor: Code_IEC: 1005; Published: 8-Jun-2000; LatestRevisionDate: 29-May-2009; LatestRevisionNote: IPC-7351 Footprint Added.; PackageReference: 0402-A; Publisher: Altium Limited; PackageDescription: Chip Inductor; Code_JEITA: 0402; LCSC: C81470
Q1 Q2 = HD60N75: N-Channel MOSFET 75V/60A; Published: 8-Jun-2000; LatestRevisionDate: 17-Jul-2002; LatestRevisionNote: Re-released for DXP Platform.; PackageVersion: 1995/1996; PackageReference: E3; Publisher: Altium Limited; PackageDescription: TO, Flat Index; 3 In-Line, Axial Leads; Body Dia. 4.6mm; Lead Dia. 0.5 mm (max); LCSC: C216253
R1 R2 R46 = Res1: Resistor; Published: 8-Jun-2000; LatestRevisionDate: 17-Jul-2002; LatestRevisionNote: Re-released for DXP Platform.; PackageReference: AXIAL-0.3; Publisher: Altium Limited; PackageDescription: Axial Device, Thru-Hole; 2 Leads; 0.3 in Pin Spacing
U2 = LM2576/HV: LCSC: C234209
D8 = LED: Published: 8-Jun-2000; LatestRevisionDate: 17-Jul-2002; LatestRevisionNote: Re-released for DXP Platform.; PackageVersion: Feb-2002; PackageReference: 3.2X1.6X1.1; Publisher: Altium Limited; PackageDescription: SM LED; 2 Flat Leads; LCSC: C205450

## Sheet IR.SchDoc
size A4
Used 4 times, as channels IR1, IR2, IR3, IR4. Parts and nets are listed once, with the designators drawn on the sheet.
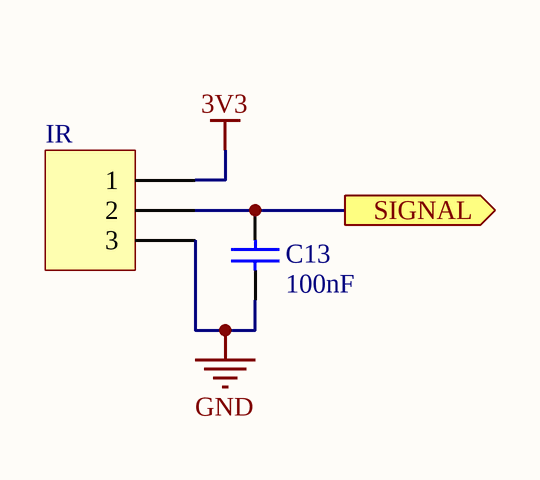
[diagram p10: IR.SchDoc]

### Parts
C13  value 100nF  [J1-0603]  (hidden comment: Cap)
IR  Header 3  [HDR1X3]  (value not drawn)

### Ports
SIGNAL (out)

### Nets
3V3: IR.1
GND: C13.1 IR.3
SIGNAL: C13.2 IR.2 ; port SIGNAL

### Channels
IR1: designators end in _1; ports SIGNAL=NetC13_1_2
IR2: designators end in _2; ports SIGNAL=NetC13_2_2
IR3: designators end in _3; ports SIGNAL=NetC13_3_2
IR4: designators end in _4; ports SIGNAL=NetC13_4_2

### Library data of the parts
C13 = Cap: Capacitor; Published: 8-Jun-2000; LatestRevisionDate: 17-Jul-2002; LatestRevisionNote: Re-released for DXP Platform.; PackageReference: RAD-0.3; Publisher: Altium Limited; PackageDescription: Radial Cap, Thru-Hole; 2 Leads; 0.3 in Pin Spacing; LCSC: C153795
IR = Header 3: Header, 3-Pin; LatestRevisionDate: 17-Jul-2002; LatestRevisionNote: Re-released for DXP Platform.; Publisher: Altium Limited

## Nets that join several sheets
3V3: 3V3StepDown (6 pins), ESP32 (10 pins), Motor 1 (R21_1.2), TOFSensorControl (Q13.2), WS2812BDriver (R43.2), Motor 2 (R21_2.2), IR1 (IR_1.1), IR2 (IR_2.1), IR3 (IR_3.1), IR4 (IR_4.1)
5V: 3V3StepDown (C1.1 VR1.3), Motor 1 (6 pins), Receiver (Receiver.1), Programming (D6.2), WS2812BDriver (P1.1 R44.2), Motor 2 (6 pins), BatteryStepDownHV (7 pins)
GND: 3V3StepDown (6 pins), ESP32 (9 pins), Motor 1 (Q4_1.2 Q5_1.2 Q6_1.2 U6_1.3), Receiver (R34.1 R35.1 R36.1 Receiver.5), Programming (9 pins), TOFSensorControl (D9.2 Q14.2 R38.2 R42.1), TOF Sensor Control/VL53L0X_A (Q12_1.2 R37_1.1 TOF_1.3), TOF Sensor Control/VL53L0X_B (Q12_2.2 R37_2.1 TOF_2.3), TOF Sensor Control/VL53L0X_C (Q12_3.2 R37_3.1 TOF_3.3), TOF Sensor Control/VL53L0X_D (Q12_4.2 R37_4.1 TOF_4.3), WS2812BDriver (P1.3), Motor 2 (Q4_2.2 Q5_2.2 Q6_2.2 U6_2.3), BatteryStepDownHV (15 pins), IR1 (C13_1.1 IR_1.3), IR2 (C13_2.1 IR_2.3), IR3 (C13_3.1 IR_3.3), IR4 (C13_4.1 IR_4.3)
BOOT: ESP32 (PROG.5 R6.1 U1.25), Programming (Q11.3), WS2812BDriver (Q15.2)
EN: ESP32 (PROG.4 R3.1 U1.3), Programming (Q10.3)
NetC13_1_2: ESP32 (U1.4), IR1 (C13_1.2 IR_1.2)
NetC13_2_2: ESP32 (U1.5), IR2 (C13_2.2 IR_2.2)
NetC13_3_2: ESP32 (U1.6), IR3 (C13_3.2 IR_3.2)
NetC13_4_2: ESP32 (U1.7), IR4 (C13_4.2 IR_4.2)
NetR17_1_1: ESP32 (U1.13), Motor 1 (R17_1.1)
NetR17_2_1: ESP32 (U1.26), Motor 2 (R17_2.1)
NetR18_1_1: ESP32 (U1.12), Motor 1 (R18_1.1)
NetR18_2_1: ESP32 (U1.23), Motor 2 (R18_2.1)
NetR19_1_1: ESP32 (U1.11), Motor 1 (R19_1.1)
NetR19_2_1: ESP32 (U1.16), Motor 2 (R19_2.1)
NetR21_1_1: ESP32 (U1.10), Motor 1 (R21_1.1 U6_1.4)
NetR21_2_1: ESP32 (U1.14), Motor 2 (R21_2.1 U6_2.4)
NetR31_1: ESP32 (U1.29), Receiver (R31.1 R34.2)
NetR32_1: ESP32 (U1.28), Receiver (R32.1 R35.2)
NetR33_1: ESP32 (U1.27), Receiver (R33.1 R36.2)
NetR41_2: ESP32 (U1.36), TOFSensorControl (R41.2)
RXD: ESP32 (PROG.3 U1.34), Programming (U7.26)
SCL: ESP32 (R5.1 U1.31), TOF Sensor Control/VL53L0X_A (TOF_1.5), TOF Sensor Control/VL53L0X_B (TOF_2.5), TOF Sensor Control/VL53L0X_C (TOF_3.5), TOF Sensor Control/VL53L0X_D (TOF_4.5)
SDA: ESP32 (R4.1 U1.33), TOF Sensor Control/VL53L0X_A (TOF_1.1), TOF Sensor Control/VL53L0X_B (TOF_2.1), TOF Sensor Control/VL53L0X_C (TOF_3.1), TOF Sensor Control/VL53L0X_D (TOF_4.1)
TOF_VCC: TOFSensorControl (Q13.3 R42.2 R47.2), TOF Sensor Control/VL53L0X_A (C12_1.1 TOF_1.2), TOF Sensor Control/VL53L0X_B (C12_2.1 TOF_2.2), TOF Sensor Control/VL53L0X_C (C12_3.1 TOF_3.2), TOF Sensor Control/VL53L0X_D (C12_4.1 TOF_4.2)
TXD: ESP32 (PROG.2 R7.1 U1.35), Programming (U7.25)